# Altium schematic sheet PowerSupply.SchDoc: Power Supply
size A4; DrawnBy: Dheeraj R; DocumentNumber: 5; Revision: 1; SheetNumber: 5; SheetTotal: 5
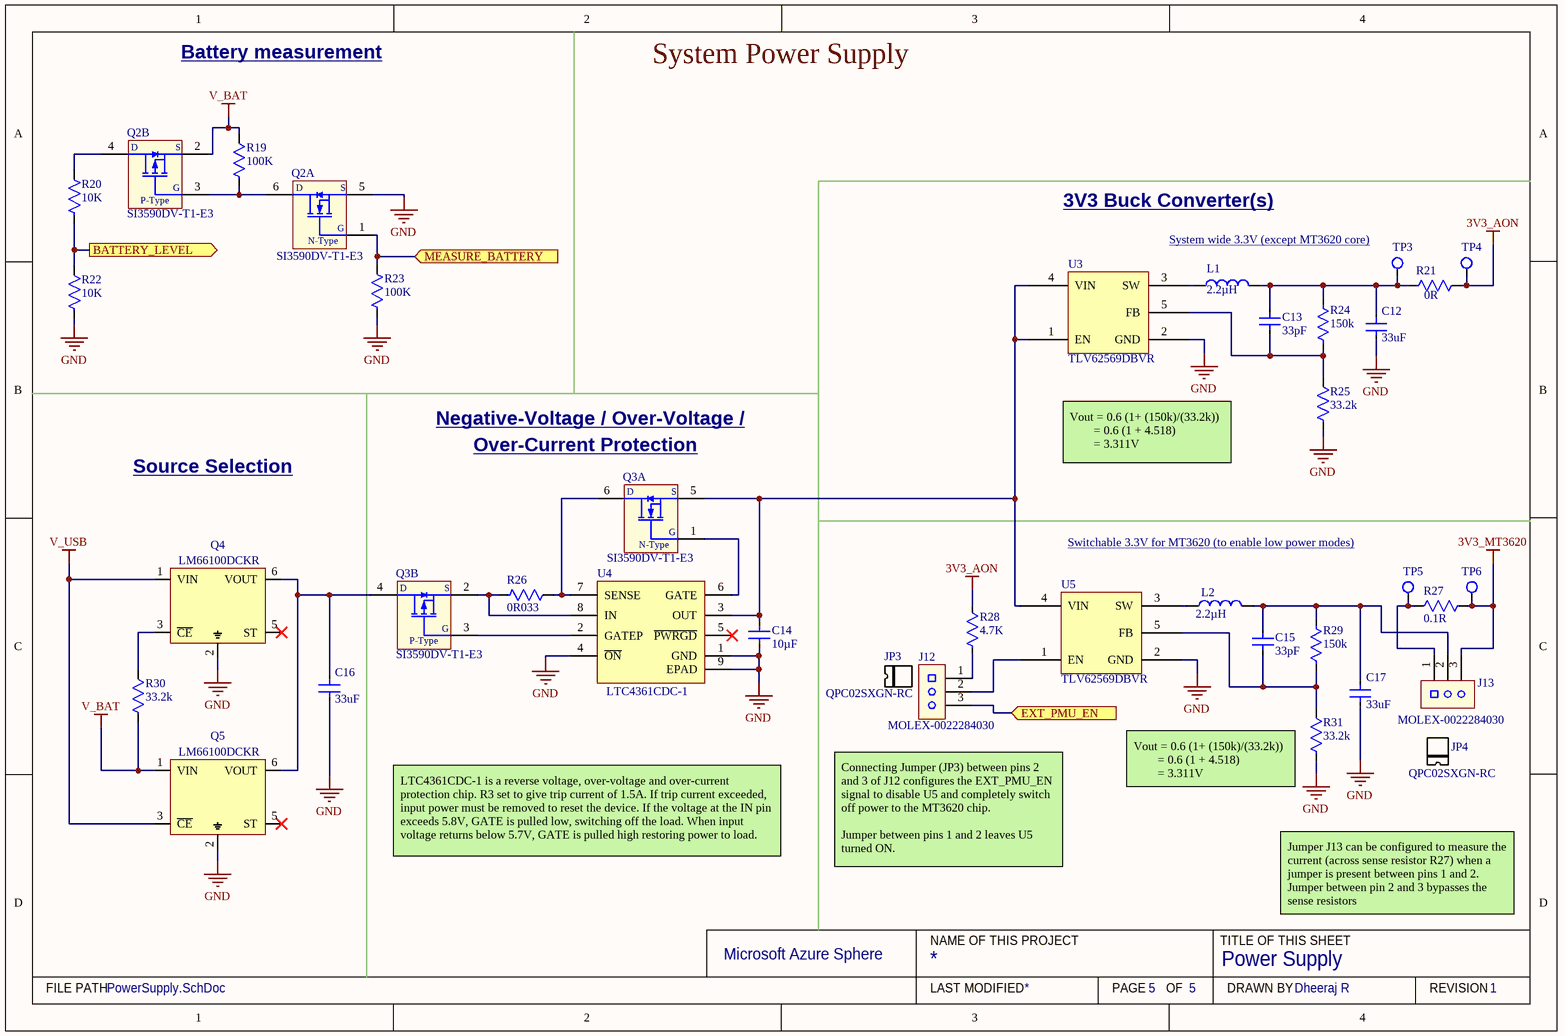
[diagram p0: PowerSupply.SchDoc]

## Parts
C12  33uF  [TDK_0805]
C13  33pF  [0603_AVX]
C14  10µF  [CAPC1608-EIA0603-1MM-MED]
C15  33pF  [0603_AVX]
C16  33uF  [TDK_0805]
C17  33uF  [TDK_0805]
J12  MOLEX-0022284030  [0022284030]
J13  MOLEX-0022284030  [0022284030]
JP3  QPC02SXGN-RC  (mechanical)
JP4  QPC02SXGN-RC  (mechanical)
L1  2.2µH  [NR3015T2R2M]
L2  2.2µH  [NR3015T2R2M]
Q2  SI3590DV-T1-E3  [SI3590DV-T1-E3]  (parts A,B of 2)
Q3  SI3590DV-T1-E3  [SI3590DV-T1-E3]  (parts A,B of 2)
Q4  LM66100DCKR  [TI-LM6610-SC-70]
Q5  LM66100DCKR  [TI-LM6610-SC-70]
R19  100K  [VISHAY-0603]
R20  10K  [VISHAY-0603]
R21  0R  [1608-EIA0603]
R22  10K  [VISHAY-0603]
R23  100K  [VISHAY-0603]
R24  150k  [RC0603]
R25  33.2k  [RC0603]
R26  0R033  [RC0603]
R27  0.1R  [VISHAY-0603]
R28  4.7K  [RC0603]
R29  150k  [RC0603]
R30  33.2k  [RC0603]
R31  33.2k  [RC0603]
TP3  TestPointHole  [PTH1.27mm-0.9mm]  (value not drawn)  (no BOM)
TP4  TestPointHole  [PTH1.27mm-0.9mm]  (value not drawn)  (no BOM)
TP5  TestPointHole  [PTH1.27mm-0.9mm]  (value not drawn)  (no BOM)
TP6  TestPointHole  [PTH1.27mm-0.9mm]  (value not drawn)  (no BOM)
U3  TLV62569DBVR  [TI-SOT23-6]
U4  LTC4361CDC-1  [LTC4361-1#TRPBF]
U5  TLV62569DBVR  [TI-SOT23-6]

## Ports
BATTERY_LEVEL (out), EXT_PMU_EN (in), MEASURE_BATTERY (in)

## Nets
3V3_AON: R21.2 R28.2 TP4.1
3V3_MT3620: J13.3 R27.2 TP6.1
GND: C12.1 C14.1 C16.1 C17.1 Q2.5(S1) Q4.2(GND) Q5.2(GND) R22.1 R23.1 R25.1 R31.1 U3.2(GND) U4.1(GND) U4.4(~{ON}) U4.9(EPAD) U5.2(GND)
V_BAT: Q2.2(S2) Q5.1(VIN) R19.2 R30.1
V_USB: Q4.1(VIN) Q5.3(~{CE})
BATTERY_LEVEL: R20.1 R22.2 ; port BATTERY_LEVEL
EXT_PMU_EN: J12.3 ; port EXT_PMU_EN
MEASURE_BATTERY: Q2.1(G1) R23.2 ; port MEASURE_BATTERY
NetC12_2: C12.2 C13.2 L1.2 R21.1 R24.2 TP3.1
NetC13_1: C13.1 R24.1 R25.2 U3.5(FB)
NetC14_2: C14.2 Q3.5(S1) U3.1(EN) U3.4(VIN) U4.3(OUT) U5.4(VIN)
NetC15_1: C15.1 R29.1 R31.2 U5.5(FB)
NetC15_2: C15.2 C17.2 J13.2 L2.2 R29.2
NetC16_2: C16.2 Q3.4(D2) Q4.6(VOUT) Q5.6(VOUT)
NetJ12_1: J12.1 R28.1
NetJ12_2: J12.2 U5.1(EN)
NetJ13_1: J13.1 R27.1 TP5.1
NetL1_1: L1.1 U3.3(SW)
NetL2_1: L2.1 U5.3(SW)
NetQ2_3: Q2.3(G2) Q2.6(D1) R19.1
NetQ2_4: Q2.4(D2) R20.2
NetQ3_1: Q3.1(G1) U4.6(GATE)
NetQ3_2: Q3.2(S2) R26.1 U4.8(IN)
NetQ3_3: Q3.3(G2) U4.2(GATEP)
NetQ3_6: Q3.6(D1) R26.2 U4.7(SENSE)
NetQ4_3: Q4.3(~{CE}) R30.2

Not connected (* = marked no-connect by the designer): Q4 4(NC) 5(ST)*; Q5 4(NC) 5(ST)*; U4 5(~{PWRGD})*

## Notes on the sheet
- Battery measurement
- System Power Supply
- 3V3 Buck Converter(s)
- System wide 3.3V (except MT3620 core)
- Negative-Voltage / Over-Voltage /
- (near Q3) Over-Current Protection
- Source Selection
- Vout = 0.6 (1+ (150k)/(33.2k))
  = 0.6 (1 + 4.518)
  = 3.311V
- Switchable 3.3V for MT3620 (to enable low power modes)
- (near R31) Vout = 0.6 (1+ (150k)/(33.2k))
  = 0.6 (1 + 4.518)
  = 3.311V
- LTC4361CDC-1 is a reverse voltage, over-voltage and over-current protection chip. R3 set to give trip current of 1.5A. If trip current exceeded, input power must be removed to reset the device. If the voltage at the IN pin exceeds 5.8V, GATE is pulled low, switching off the load. When input voltage returns below 5.7V, GATE is pulled high restoring power to load.
- (near J12) Connecting Jumper (JP3) between pins 2 and 3 of J12 configures the EXT_PMU_EN signal to disable U5 and completely switch off power to the MT3620 chip.
  Jumper between pins 1 and 2 leaves U5 turned ON.
- Jumper J13 can be configured to measure the current (across sense resistor R27) when a jumper is present between pins 1 and 2.
  Jumper between pin 2 and 3 bypasses the sense resistors
- Microsoft Azure Sphere
- NAME OF THIS PROJECT
- TITLE OF THIS SHEET
- FILE PATH
- LAST MODIFIED
- PAGE
- OF
- DRAWN BY
- REVISION
- (in symbol SI3590DV-T1-E3, part A) D; S; G; N-Type
- (in symbol SI3590DV-T1-E3, part B) D; S; G; P-Type

## Library data of the parts
C12 C16 C17 = 33uF 0805 X5R 10V: CAP CER 33UF 10V X5R 0805; Manufacturer: TDK; Manufacturer Part Number: C2012X5R1A336M125AC; Dielectric Material: Ceramic; Tolerance: 20%; Supplier 1: Digi-Key; RoHS: Yes; Category: Ceramic Capacitors; Stock 1: 30620; Pricing 1: 1=1.03000, 10=0.78700, 50=0.65340, 100=0.56270, 500=0.43560, 1000=0.37510 (USD); Mount: Surface Mount; Case/Package: 0805; Weight: 0.000194oz; Case Code (Metric): 2012; Case Code (Imperial): 0805; Min Operating Temperature: -55°C; Max Operating Temperature: 85°C; Capacitance: 33uF; Voltage Rating: 10V; Packaging: Tape and Reel; Termination: SMD/SMT; Package Quantity: 1; Voltage Rating (DC): 10V; Composition: Ceramic; Dielectric: X5R; Length: 2mm; Height: 1.25mm; Width: 0.049inch; Thickness: 0.057inch; Depth: 1.25mm; REACH SVHC: No SVHC; Lead Free: Lead Free; ComponentLink1URL: https://datasheet.ciiva.com/24216/c2012x5r1a336m125ac-264804-24216541.pdf?src-supplier=Mouser; ComponentLink1Description: https://datasheet.ciiva.com/24216/c2012x5r1a336m125ac-264804-24216541.pdf?src-supplier=Mouser; ComponentLink2URL: https://datasheet.ciiva.com/6259/tdkmlcccaprange-6259263.pdf?src-supplier=Digi-Key; ComponentLink2Description: https://datasheet.ciiva.com/6259/tdkmlcccaprange-6259263.pdf?src-supplier=Digi-Key; Supplier Part Number 1: 445-8238-1-ND
C13 C15 = 0603YC330JAT2A: 33 pF, 16 V, 0603 [1608 Metric], ± 5%, X7R, AVX 0603 MLCC, AVX - 0603YC330JAT2A - SMD Multilayer Ceramic Capacitor; Manufacturer: Kyocera AVX; Voltage Rating (DC): 16V; Dissipation Factor: 3.5%; Supplier 1: Digi-Key; Manufacturer Part Number: 0603YC330JAT2A; RoHS: Yes; Category: Ceramic Capacitors; Stock 1: 15613; Pricing 1: 1=0.21000, 10=0.14200, 100=0.07210, 500=0.04934, 1000=0.04364 (USD); Mount: Surface Mount; Case/Package: 0603; Number of Pins: 2; Case Code (Imperial): 0603; Case Code (Metric): 1608; Min Operating Temperature: -55°C; Max Operating Temperature: 125°C; Capacitance: 33pF; Tolerance: 5%; Packaging: Tape and Reel; Dielectric: X7R; Package Quantity: 4000; Voltage Rating: 16V; Termination: SMD/SMT; Length: 1.6mm; Width: 0.81mm; Thickness: 0.035inch; Depth: 0.81mm; Radiation Hardening: No; REACH SVHC: No SVHC; Lead Free: Lead Free; ComponentLink1URL: https://datasheet.ciiva.com/150/cx7r-150936.pdf?src-supplier=Digi-Key; ComponentLink1Description: https://datasheet.ciiva.com/150/cx7r-150936.pdf?src-supplier=Digi-Key; ComponentLink2URL: https://datasheet.ciiva.com/150/cx7r-150937.pdf?src-supplier=Digi-Key; ComponentLink2Description: https://datasheet.ciiva.com/150/cx7r-150937.pdf?src-supplier=Digi-Key; ComponentLink3URL: https://datasheet.ciiva.com/150/cx7r-150938.pdf?src-supplier=Digi-Key; ComponentLink3Description: https://datasheet.ciiva.com/150/cx7r-150938.pdf?src-supplier=Digi-Key; ComponentLink4URL: https://datasheet.ciiva.com/22676/1679506-22676970.pdf?src-supplier=Element14; ComponentLink4Description: https://datasheet.ciiva.com/22676/1679506-22676970.pdf?src-supplier=Element14; ComponentLink5URL: https://datasheet.ciiva.com/28533/1679506-28533438.pdf?src-supplier=Element14; ComponentLink5Description: https://datasheet.ciiva.com/28533/1679506-28533438.pdf?src-supplier=Element14; Supplier Part Number 1: 478-6211-1-ND
C14 = 10µF 0603 X5R 25V: CAP CER 10UF 25V 20% X5R 0603; Manufacturer: TDK Corporation; Manufacturer Part Number: C1608X5R1E106M080AC; Supplier 1: Digi-Key; RoHS: RoHS Compliant; Category: Capacitors; Stock 1: 47833; Pricing 1: 0.00754; Packaging: Tape & Reel (TR); Tolerance: ±20%; Voltage - Rated: 25V; Temperature Coefficient: X5R; Mounting Type: Surface Mount, MLCC; Operating Temperature: -55°C ~ 125°C; Applications: General Purpose; Package / Case: 0603 (1608 Metric); Size / Dimension: 0.063" L x 0.031" W (1.60mm x 0.80mm); Height - Seated (Max): -; Thickness (Max): 0.039" (1.00mm); Lead Spacing: -; Features: -; Lead Style: -; ComponentLink1URL: http://product.tdk.com/en/catalog/datasheets/mlcc_commercial_general_en.pdf; ComponentLink1Description: http://product.tdk.com/en/catalog/datasheets/mlcc_commercial_general_en.pdf; Supplier Part Number 1: 445-9015-2-ND; Ratings: -; Capacitance: 10µF
J12 J13 = MOLEX-0022284030: CONN HEADER 3POS .100 VERT TIN; Manufacturer: Molex, LLC; Connector Type: Header, Unshrouded, Breakaway; Number of Positions: 3; Number of Positions Loaded: All; Pitch: 0.100" (2.54mm); Supplier 1: Digi-Key; Manufacturer Part Number: 0022284030; RoHS: RoHS Compliant; Category: Connectors, Interconnects; Stock 1: 4665; Pricing 1: 1=0.12, 10=0.115, 25=0.0984, 50=0.086, 100=0.0799, 250=0.07068, 500=0.0676 (GBP); Packaging: Bulk; Contact Type: Male Pin; Number of Rows: 1; Row Spacing: -; Contact Mating Length: 0.240" (6.10mm); Mounting Type: Through Hole; Termination: Solder; Fastening Type: -; Features: -; Contact Finish: Tin; Contact Finish Thickness: 100µin (2.54µm); Color: Black; ComponentLink1URL: http://www.molex.com/pdm_docs/sd/022284030_sd.pdf; ComponentLink1Description: http://www.molex.com/pdm_docs/sd/022284030_sd.pdf; Supplier Part Number 1: WM50014-03-ND
JP3 JP4 = QPC02SXGN-RC: CONN JUMPER SHORTING .100" GOLD; Manufacturer: Sullins; Number of Positions: 2; Pitch: 0.1inch; Supplier 1: Digi-Key; Manufacturer Part Number: QPC02SXGN-RC; RoHS: Yes; Category: Connectors; Stock 1: 717508; Pricing 1: 1=0.10000, 10=0.05900, 25=0.04400, 50=0.03780, 100=0.03650, 250=0.03152, 500=0.03024, 1000=0.02646, 2500=0.02394 (USD); Case/Package: 100; Contact Plating: Gold; Package Quantity: 2000; Packaging: Bulk; Height: 0.235inch; Lead Free: Lead Free; ComponentLink1URL: https://datasheet.ciiva.com/767/284-sxgn-11510-767869.pdf?src-supplier=Digi-Key; ComponentLink1Description: https://datasheet.ciiva.com/767/284-sxgn-11510-767869.pdf?src-supplier=Digi-Key; Supplier Part Number 1: S9337-ND
L1 L2 = NR3015T2R2M: FIXED IND 2.2UH 1.5A 72 MOHM SMD; Manufacturer: Taiyo Yuden; Type: Wirewound; Material - Core: Ferrite; Tolerance: ±20%; Current - Saturation: 1.48A; Shielding: Shielded; DC Resistance (DCR): 72 mOhm Max; Frequency - Self Resonant: 64MHz; Frequency - Test: 100kHz; Supplier 1: Digi-Key; Manufacturer Part Number: NR3015T2R2M; RoHS: RoHS Compliant; Category: Inductors, Coils, Chokes; Stock 1: 150589; Pricing 1: 1=0.23, 10=0.209, 25=0.1864, 50=0.163, 100=0.1513, 250=0.13964, 500=0.13268, 1000=0.10707 (GBP); Packaging: Cut Tape (CT); Inductance: 2.2µH; Current Rating: 1.5A; Q @ Freq: -; Ratings: -; Operating Temperature: -25°C ~ 120°C; Mounting Type: Surface Mount; Package / Case: Nonstandard; Size / Dimension: 0.118" L x 0.118" W (3.00mm x 3.00mm); Height - Seated (Max): 0.059" (1.50mm); ComponentLink1URL: http://ds.yuden.co.jp/TYCOMPAS/ut/detail.do?productNo=NR3015T2R2M&fileName=NR3015T2R2M_SS&mode=specSheetDownload; ComponentLink1Description: http://ds.yuden.co.jp/TYCOMPAS/ut/detail.do?productNo=NR3015T2R2M&fileName=NR3015T2R2M_SS&mode=specSheetDownload; Supplier Part Number 1: 587-1648-1-ND
Q2 Q3 = SI3590DV-T1-E3: MOSFET N&P-CH 30V (D-S); Manufacturer: Vishay Siliconix; Nominal Vgs: 600mV; Rds On Max: 77mR; Rise Time: 15ns; Continuous Drain Current (ID): 2.5A; Max Power Dissipation: 830mW; Drain to Source Resistance: 170mR; Gate to Source Voltage (Vgs): 12V; Turn-Off Delay Time: 20ns; Number of Elements: 2; Turn-On Delay Time: 5ns; Supplier 1: Digi-Key; Manufacturer Part Number: SI3590DV-T1-E3; Stock 1: 43293; Pricing 1: 1=0.71, 10=0.612, 25=0.5712, 100=0.4568, 250=0.4242, 500=0.3589, 1000=0.2774 (USD); Mount: Surface Mount; Case/Package: TSOP; Number of Pins: 6; Weight: 0.000705oz; Min Operating Temperature: -55°C; Max Operating Temperature: 150°C; Packaging: Tape and Reel; Package Quantity: 3000; Drain to Source Voltage (Vdss): 30V; Drain to Source Breakdown Voltage: 30V; Fall Time: 15ns; Power Dissipation: 830mW; Number of Channels: 2; Length: 3.05mm; Height: 1mm; Width: 1.65mm; Radiation Hardening: No; REACH SVHC: Unknown; Lead Free: Lead Free; ComponentLink1URL: https://datasheet.ciiva.com/4441/72032-244663-4441688.pdf; ComponentLink1Description: https://datasheet.ciiva.com/4441/72032-244663-4441688.pdf; ComponentLink2URL: https://datasheet.ciiva.com/11158/72032-11158835.pdf; ComponentLink2Description: https://datasheet.ciiva.com/11158/72032-11158835.pdf; ComponentLink3URL: https://datasheet.ciiva.com/6388/72032-6388120.pdf; ComponentLink3Description: https://datasheet.ciiva.com/6388/72032-6388120.pdf; ComponentLink4URL: https://datasheet.ciiva.com/6388/72032-6388117.pdf; ComponentLink4Description: https://datasheet.ciiva.com/6388/72032-6388117.pdf; ComponentLink5URL: https://datasheet.ciiva.com/26145/72032-26145319.pdf; ComponentLink5Description: https://datasheet.ciiva.com/26145/72032-26145319.pdf; Supplier Part Number 1: SI3590DV-T1-E3DKR-ND
Q4 Q5 = LM66100DCKR: 1.5-V to 5.5-V, 1.5-A, 0.5-uA IQ ideal diode with Integrated FET 6-SC70 -40 to 105; Manufacturer: Texas Instruments; Supplier 1: Digi-Key; Manufacturer Part Number: LM66100DCKR; RoHS: No; Category: Integrated Circuits (ICs); Stock 1: 4176; Pricing 1: 1=0.41000, 10=0.32900, 25=0.30120, 100=0.20300, 250=0.16800, 500=0.15400, 1000=0.11550 (USD); Supplier Part Number 1: 296-53541-1-ND
R19 R23 = RC0603FR-07100KL: 100K Ohm 0603 1% 0.1W(1/10W) 100ppm Paper T/R; Manufacturer: Yageo; Resistance: 100kR; Temperature Coefficient: 100ppm/°C; Voltage Rating (DC): 50V; Power Rating: 100mW; Working Voltage: 75V; Supplier 1: Digi-Key; Manufacturer Part Number: RC0603FR-07100KL; RoHS: Yes; Category: Chip SMD Resistors; Stock 1: 18400350; Pricing 1: 1=0.10000, 10=0.02300, 100=0.00940, 1000=0.00421, 2500=0.00366 (USD); Case/Package: 0603; Number of Pins: 2; Case Code (Imperial): 0603; Case Code (Metric): 1608; Min Operating Temperature: -55°C; Max Operating Temperature: 155°C; Tolerance: 1%; Composition: Thick Film; Packaging: Tape and Reel; Voltage Rating: 50V; Termination: SMD/SMT; Military Standard: Not; Number of Terminations: 2; Length: 1.6mm; Height: 0.45mm; Width: 0.8mm; Depth: 0.8mm; REACH SVHC: No SVHC; Lead Free: Lead Free; ComponentLink1URL: https://datasheet.ciiva.com/11808/0900766b80f96399-11808107.pdf?src-supplier=RSComponents; ComponentLink1Description: https://datasheet.ciiva.com/11808/0900766b80f96399-11808107.pdf?src-supplier=RSComponents; ComponentLink2URL: https://datasheet.ciiva.com/7983/443971-7983593.pdf?src-supplier=Element14; ComponentLink2Description: https://datasheet.ciiva.com/7983/443971-7983593.pdf?src-supplier=Element14; ComponentLink3URL: https://datasheet.ciiva.com/46440/1868787-46440889.pdf?src-supplier=Element14; ComponentLink3Description: https://datasheet.ciiva.com/46440/1868787-46440889.pdf?src-supplier=Element14; ComponentLink4URL: https://datasheet.ciiva.com/7746/1738695-7746234.pdf?src-supplier=Element14; ComponentLink4Description: https://datasheet.ciiva.com/7746/1738695-7746234.pdf?src-supplier=Element14; ComponentLink5URL: https://datasheet.ciiva.com/7746/1738695-7746235.pdf?src-supplier=Element14; ComponentLink5Description: https://datasheet.ciiva.com/7746/1738695-7746235.pdf?src-supplier=Element14; ComponentLink6URL: https://datasheet.ciiva.com/22747/443971-22747516.pdf?src-supplier=Element14; ComponentLink6Description: https://datasheet.ciiva.com/22747/443971-22747516.pdf?src-supplier=Element14; Supplier Part Number 1: 311-100KHRCT-ND
R20 R22 = RC0603FR-0710KL: 10K Ohm 0603 1% 1/10W ±100ppm/°C Molded SMD Paper T/R; Manufacturer: Yageo; Resistance: 10kR; Voltage Rating (DC): 50V; Power Rating: 100mW; Voltage Rating: 75V; Supplier 1: Farnell; Manufacturer Part Number: RC0603FR-0710KL; RoHS: Yes; Category: Chip SMD Resistors; Stock 1: 650865; Pricing 1: 10=0.01950, 100=0.01660, 500=0.01160, 1000=0.00890, 2500=0.00660 (GBP); Case/Package: 0603; Number of Pins: 2; Weight: 7.1E-05oz; Case Code (Imperial): 0603; Case Code (Metric): 1608; Min Operating Temperature: -55°C; Max Operating Temperature: 155°C; Tolerance: 1%; Composition: Thick Film; Temperature Coefficient: 100ppm/°C; Packaging: Tape and Reel; Military Standard: Not; Termination: SMD/SMT; Length: 1.6mm; Height: 0.45mm; Width: 0.8mm; Depth: 0.8mm; Lead Pitch: 0.3mm; REACH SVHC: No SVHC; Lead Free: Lead Free; ComponentLink1URL: https://datasheet.ciiva.com/7660/38590-7660789.pdf?src-supplier=Element14; ComponentLink1Description: https://datasheet.ciiva.com/7660/38590-7660789.pdf?src-supplier=Element14; ComponentLink2URL: https://datasheet.ciiva.com/15189/getdatasheetpartid-409289-15189591.pdf?src-supplier=Verical; ComponentLink2Description: https://datasheet.ciiva.com/15189/getdatasheetpartid-409289-15189591.pdf?src-supplier=Verical; ComponentLink3URL: https://datasheet.ciiva.com/46440/1868787-46440891.pdf?src-supplier=Element14; ComponentLink3Description: https://datasheet.ciiva.com/46440/1868787-46440891.pdf?src-supplier=Element14; ComponentLink4URL: https://datasheet.ciiva.com/7983/443971-7983596.pdf?src-supplier=Element14; ComponentLink4Description: https://datasheet.ciiva.com/7983/443971-7983596.pdf?src-supplier=Element14; ComponentLink5URL: https://datasheet.ciiva.com/7746/1738695-7746239.pdf?src-supplier=Element14; ComponentLink5Description: https://datasheet.ciiva.com/7746/1738695-7746239.pdf?src-supplier=Element14; ComponentLink6URL: https://datasheet.ciiva.com/22747/443971-22747519.pdf?src-supplier=Element14; ComponentLink6Description: https://datasheet.ciiva.com/22747/443971-22747519.pdf?src-supplier=Element14; Supplier Part Number 1: 9238603
R21 = RC0603JR-070RL: YAGEO         RC0603JR-070RL             RES, THICK FILM, 0R, 0.1W, 0603; Resistance: 0mR; Tolerance: 1%; Voltage Rating: 50V; Power Rating: 100mW; Temperature Coefficient: 200ppm/°C; Supplier 1: Digi-Key; Manufacturer: Yageo; Manufacturer Part Number: RC0603JR-070RL; Stock 1: 17127674; Pricing 1: 1=0.1, 10=0.01, 25=0.0072, 50=0.0056, 100=0.0041, 250=0.0032, 500=0.0025, 1000=0.0019 (USD); Case/Package: 0603; Number of Pins: 2; Case Code (Imperial): 0603; Case Code (Metric): 1608; Contact Plating: Tin,Matte; Min Operating Temperature: -55°C; Max Operating Temperature: 155°C; Package Quantity: 5000; Packaging: Tape and Reel; Voltage Rating (DC): 50V; Termination: SMD/SMT; Composition: Thick Film; Military Standard: Not; Length: 1.6mm; Height: 0.45mm; Width: 0.8mm; Depth: 0.8mm; Radiation Hardening: No; REACH SVHC: No SVHC; Lead Free: Lead Free; ComponentLink1URL: https://datasheet.ciiva.com/11808/pyu-r-int-6-11808700.pdf; ComponentLink1Description: https://datasheet.ciiva.com/11808/pyu-r-int-6-11808700.pdf; ComponentLink2URL: https://datasheet.ciiva.com/12555/rc0603-272842-12555254.pdf; ComponentLink2Description: https://datasheet.ciiva.com/12555/rc0603-272842-12555254.pdf; ComponentLink3URL: https://datasheet.ciiva.com/22747/443971-22747530.pdf; ComponentLink3Description: https://datasheet.ciiva.com/22747/443971-22747530.pdf; ComponentLink4URL: https://datasheet.ciiva.com/7746/1738695-7746421.pdf; ComponentLink4Description: https://datasheet.ciiva.com/7746/1738695-7746421.pdf; ComponentLink5URL: https://datasheet.ciiva.com/8883/pyu-rc0603-51-rohs-l-4-8883045.pdf; ComponentLink5Description: https://datasheet.ciiva.com/8883/pyu-rc0603-51-rohs-l-4-8883045.pdf; ComponentLink6URL: https://datasheet.ciiva.com/15189/getdatasheetpartid-329462-15189845.pdf; ComponentLink6Description: https://datasheet.ciiva.com/15189/getdatasheetpartid-329462-15189845.pdf; ComponentLink7URL: https://datasheet.ciiva.com/7746/1738695-7746422.pdf; ComponentLink7Description: https://datasheet.ciiva.com/7746/1738695-7746422.pdf; Supplier Part Number 1: 311-0.0GRCT-ND
R24 R29 = RC0603FR-07150KL: 150 kohm, RC Series, 75 V, Thick Film, 100 mW, YAGEO - RC0603FR-07150KL - SMD Chip Resistor, 0603 [1608 Metric]; Resistance: 150kR; Tolerance: 1%; Temperature Coefficient: 100ppm/°C; Voltage Rating (DC): 50V; Power Rating: 100mW; Supplier 1: Digi-Key; Manufacturer: Yageo; Manufacturer Part Number: RC0603FR-07150KL; RoHS: Yes; Category: Chip SMD Resistors; Stock 1: 1504722; Pricing 1: 1=0.10000, 10=0.02300, 100=0.00940, 1000=0.00421, 2500=0.00366 (USD); Case/Package: 0603; Number of Pins: 2; Case Code (Metric): 1608; Case Code (Imperial): 0603; Min Operating Temperature: -55°C; Max Operating Temperature: 155°C; Composition: Thick Film; Packaging: Tape and Reel; Package Quantity: 1; Voltage Rating: 50V; Number of Terminations: 2; Termination: SMD/SMT; Military Standard: Not; Max Power Dissipation: 100mW; Features: Moisture Resistant; Length: 0.063inch; Height: 0.022inch; Width: 0.031inch; Depth: 0.8mm; REACH SVHC: No SVHC; Lead Free: Lead Free; ComponentLink1URL: https://datasheet.ciiva.com/2454/pyu-r-int-thick-7-2454080.pdf?src-supplier=Digi-Key; ComponentLink1Description: https://datasheet.ciiva.com/2454/pyu-r-int-thick-7-2454080.pdf?src-supplier=Digi-Key; ComponentLink2URL: https://datasheet.ciiva.com/15189/getdatasheetpartid-326478-15189611.pdf?src-supplier=Verical; ComponentLink2Description: https://datasheet.ciiva.com/15189/getdatasheetpartid-326478-15189611.pdf?src-supplier=Verical; ComponentLink3URL: https://datasheet.ciiva.com/46412/443971-46412843.pdf?src-supplier=Element14; ComponentLink3Description: https://datasheet.ciiva.com/46412/443971-46412843.pdf?src-supplier=Element14; ComponentLink4URL: https://datasheet.ciiva.com/46440/1868787-46440892.pdf?src-supplier=Element14; ComponentLink4Description: https://datasheet.ciiva.com/46440/1868787-46440892.pdf?src-supplier=Element14; ComponentLink5URL: https://datasheet.ciiva.com/2454/pyu-r-int-thick-7-2454078.pdf?src-supplier=Digi-Key; ComponentLink5Description: https://datasheet.ciiva.com/2454/pyu-r-int-thick-7-2454078.pdf?src-supplier=Digi-Key; ComponentLink6URL: https://datasheet.ciiva.com/7746/443971-7746254.pdf?src-supplier=Element14; ComponentLink6Description: https://datasheet.ciiva.com/7746/443971-7746254.pdf?src-supplier=Element14; ComponentLink7URL: https://datasheet.ciiva.com/2454/pyu-r-int-thick-7-2454079.pdf?src-supplier=Digi-Key; ComponentLink7Description: https://datasheet.ciiva.com/2454/pyu-r-int-thick-7-2454079.pdf?src-supplier=Digi-Key; ComponentLink8URL: https://datasheet.ciiva.com/7746/443971-7746255.pdf?src-supplier=Element14; ComponentLink8Description: https://datasheet.ciiva.com/7746/443971-7746255.pdf?src-supplier=Element14; Supplier Part Number 1: 311-150KHRCT-ND
R25 R30 R31 = RC0603FR-0733K2L: 33.2K OHM 1% 1/10W 0603; Manufacturer: Yageo; Resistance: 33.2kR; Power Rating: 100mW; Voltage Rating: 50V; Temperature Coefficient: 100ppm/°C; Supplier 1: Digi-Key; Manufacturer Part Number: RC0603FR-0733K2L; RoHS: Yes; Category: Chip SMD Resistors; Stock 1: 1286508; Pricing 1: 1=0.10000, 10=0.02300, 100=0.00940, 1000=0.00421, 2500=0.00366 (USD); Mount: Surface Mount; Case/Package: 0603; Case Code (Imperial): 0603; Case Code (Metric): 1608; Min Operating Temperature: -55°C; Max Operating Temperature: 155°C; Tolerance: 1%; Packaging: Tape and Reel; Termination: SMD/SMT; Composition: Thick Film; Military Standard: Not; Voltage Rating (DC): 50V; Length: 1.6mm; Height: 0.45mm; Depth: 0.8mm; Lead Free: Lead Free; ComponentLink1URL: https://datasheet.ciiva.com/11808/0900766b80f96399-11808316.pdf?src-supplier=RSComponents; ComponentLink1Description: https://datasheet.ciiva.com/11808/0900766b80f96399-11808316.pdf?src-supplier=RSComponents; Supplier Part Number 1: 311-33.2KHRCT-ND
R26 = RL0603FR-070R033L: 0.033 Ohm 0603 1% 0.1W(1/10W) ±1500ppm/C Epoxy Pad SMD Automotive T/R; Manufacturer: Yageo; Resistance: 33mR; Temperature Coefficient: 300ppm/°C; Power Rating: 100mW; Supplier 1: Digi-Key; Manufacturer Part Number: RL0603FR-070R033L; RoHS: Yes; Category: Chip SMD Resistors; Stock 1: 18260; Pricing 1: 1=0.52000, 10=0.37500, 100=0.19480, 1000=0.10865 (USD); Case/Package: 0603; Weight: 7.1E-05oz; Contact Plating: Tin,Matte; Case Code (Imperial): 0603; Case Code (Metric): 1608; Min Operating Temperature: -55°C; Max Operating Temperature: 125°C; Tolerance: 1%; Composition: Thick Film; Package Quantity: 5000; Termination: SMD/SMT; Packaging: Tape and Reel; Military Standard: Not; Length: 1.6mm; Height: 0.45mm; Depth: 0.8mm; Width: 0.8mm; Radiation Hardening: No; Lead Free: Lead Free; ComponentLink1URL: https://datasheet.ciiva.com/8889/pyu-rl-521-rohs-l-5-8889560.pdf?src-supplier=Avnet; ComponentLink1Description: https://datasheet.ciiva.com/8889/pyu-rl-521-rohs-l-5-8889560.pdf?src-supplier=Avnet; ComponentLink2URL: https://datasheet.ciiva.com/28401/pyu-rl-521-rohs-l-5-28401020.pdf?src-supplier=Avnet+Europe; ComponentLink2Description: https://datasheet.ciiva.com/28401/pyu-rl-521-rohs-l-5-28401020.pdf?src-supplier=Avnet+Europe; ComponentLink3URL: https://datasheet.ciiva.com/15328/pyu-rl-521-rohs-l-5-15328893.pdf?src-supplier=Mouser; ComponentLink3Description: https://datasheet.ciiva.com/15328/pyu-rl-521-rohs-l-5-15328893.pdf?src-supplier=Mouser; Supplier Part Number 1: 311-.033QCT-ND
R27 = KDV06DR100ET: 0.1 Ohm 0603 0.5% 0.20W Current Sense Rohs Compliant: Yes; Manufacturer: Ohmite; Supplier 1: Farnell; Manufacturer Part Number: KDV06DR100ET; Stock 1: 4787; Pricing 1: 1=0.06600, 10=0.03500, 25=0.03000, 50=0.02900, 100=0.02800, 500=0.02700 (GBP); ComponentLink1URL: http://www.farnell.com/datasheets/2838152.pdf?src-supplier=Farnell; ComponentLink1Description: http://www.farnell.com/datasheets/2838152.pdf?src-supplier=Farnell; Supplier Part Number 1: 3273622
R28 = RC0603FR-074K7L: 4.7K OHM 0603 1% 1/10W; Manufacturer: Yageo; Resistance: 4.7kR; Temperature Coefficient: 100ppm/°C; Power Rating: 100mW; Voltage Rating (DC): 50V; Supplier 1: Digi-Key; Manufacturer Part Number: RC0603FR-074K7L; RoHS: Yes; Category: Chip SMD Resistors; Stock 1: 975603; Pricing 1: 1=0.10000, 10=0.02300, 100=0.00940, 1000=0.00421, 2500=0.00366 (USD); Case/Package: 0603; Number of Pins: 2; Case Code (Imperial): 0603; Case Code (Metric): 1608; Min Operating Temperature: -55°C; Max Operating Temperature: 155°C; Tolerance: 1%; Composition: Thick Film; Packaging: Tape and Reel; Voltage Rating: 50V; Termination: SMD/SMT; Military Standard: Not; Length: 1.6mm; Height: 0.45mm; Width: 0.8mm; Depth: 0.8mm; Lead Pitch: 0.3mm; REACH SVHC: No SVHC; Lead Free: Lead Free; ComponentLink1URL: https://datasheet.ciiva.com/15189/getdatasheetpartid-422754-15189760.pdf?src-supplier=Verical; ComponentLink1Description: https://datasheet.ciiva.com/15189/getdatasheetpartid-422754-15189760.pdf?src-supplier=Verical; ComponentLink2URL: https://datasheet.ciiva.com/22747/443971-22747528.pdf?src-supplier=Element14; ComponentLink2Description: https://datasheet.ciiva.com/22747/443971-22747528.pdf?src-supplier=Element14; ComponentLink3URL: https://datasheet.ciiva.com/7660/38590-7660794.pdf?src-supplier=Element14; ComponentLink3Description: https://datasheet.ciiva.com/7660/38590-7660794.pdf?src-supplier=Element14; ComponentLink4URL: https://datasheet.ciiva.com/7746/1868787-7746365.pdf?src-supplier=Element14; ComponentLink4Description: https://datasheet.ciiva.com/7746/1868787-7746365.pdf?src-supplier=Element14; ComponentLink5URL: https://datasheet.ciiva.com/46440/1868787-46440909.pdf?src-supplier=Element14; ComponentLink5Description: https://datasheet.ciiva.com/46440/1868787-46440909.pdf?src-supplier=Element14; ComponentLink6URL: https://datasheet.ciiva.com/7746/1738695-7746366.pdf?src-supplier=Element14; ComponentLink6Description: https://datasheet.ciiva.com/7746/1738695-7746366.pdf?src-supplier=Element14; Supplier Part Number 1: 311-4.70KHRCT-ND
TP3-TP6 = TestPointHole: Test Point With Hole
U3 U5 = TLV62569DBVR: Variable voltage buck converter; pin to pad: 5>6; Manufacturer: Texas Instruments; Supplier 1: Digi-Key; Manufacturer Part Number: TLV62569DBVR; Stock 1: 4987; Pricing 1: 1=1.32, 10=1.176, 100=0.9168, 500=0.75736, 1000=0.59792 (USD); Case/Package: SOT-23-5; Min Operating Temperature: -40°C; Max Operating Temperature: 125°C; Supplier Part Number 1: 296-47360-6-ND
U4 = LTC4361CDC-1#TRMPBF: LINEAR TECHNOLOGY LTC4361CDC-1#TRMPBF IC, OVERVOLTAGE/CUR PROT, 8DFN; Product Training Modules: LTC4360 LTC4361 LTC4362 Overview; Featured Product: LTC436x Series Overvoltage / Overcurrent Protection Controllers; Internal Switch(s): No; Voltage - Supply: 2.5 V ~ 5.5 V; Dynamic Catalog: Overvoltage, Overcurrent Protection; Other Names: LTC4361CDC-1#TRMPBFCT; Supplier 1: Digikey; Manufacturer: Linear Technology; Manufacturer Part Number: LTC4361CDC-1#TRMPBF; Stock 1: 274; Pricing 1: 1=3.46, 25=3.0904, 100=2.04, 250=1.87 (USD); Standard Package: 1; Category: Integrated Circuits (ICs); Family: PMIC - Hot Swap, PoE Controllers; Series: -; Type: Overvoltage and Overcurrent Controller; Applications: General Purpose; Current Limit: -; Operating Temperature: 0°C ~ 70°C; Mounting Type: Surface Mount; Package / Case: 8-WFDFN Exposed Pad; Supplier Device Package: 8-DFN (2x2); Packaging: Cut Tape (CT); ComponentLink1URL: https://datasheet.ciiva.com/1511/1692593-1511384.pdf; ComponentLink1Description: https://datasheet.ciiva.com/1511/1692593-1511384.pdf; ComponentLink2URL: https://datasheet.ciiva.com/1941/29266-1941720.pdf; ComponentLink2Description: https://datasheet.ciiva.com/1941/29266-1941720.pdf; ComponentLink3URL: https://datasheet.ciiva.com/1941/29266-1941721.pdf; ComponentLink3Description: https://datasheet.ciiva.com/1941/29266-1941721.pdf; ComponentLink4URL: https://datasheet.ciiva.com/1569/1441932-1569140.pdf; ComponentLink4Description: https://datasheet.ciiva.com/1569/1441932-1569140.pdf; ComponentLink5URL: https://datasheet.ciiva.com/1569/1441932-1569141.pdf; ComponentLink5Description: https://datasheet.ciiva.com/1569/1441932-1569141.pdf; ComponentLink6URL: https://datasheet.ciiva.com/1941/29266-1941719.pdf; ComponentLink6Description: https://datasheet.ciiva.com/1941/29266-1941719.pdf; Supplier Part Number 1: LTC4361CDC-1#TRMPBFDKR-ND